# EasyEDA schematic schematics.json

## Sheets
1 PCB en Paralelo: TITLE: Sheet_1; REV: 1.0; Date: 2025-01-07; Sheet: 1/1; Drawn By: a01800096; Company: Your Company
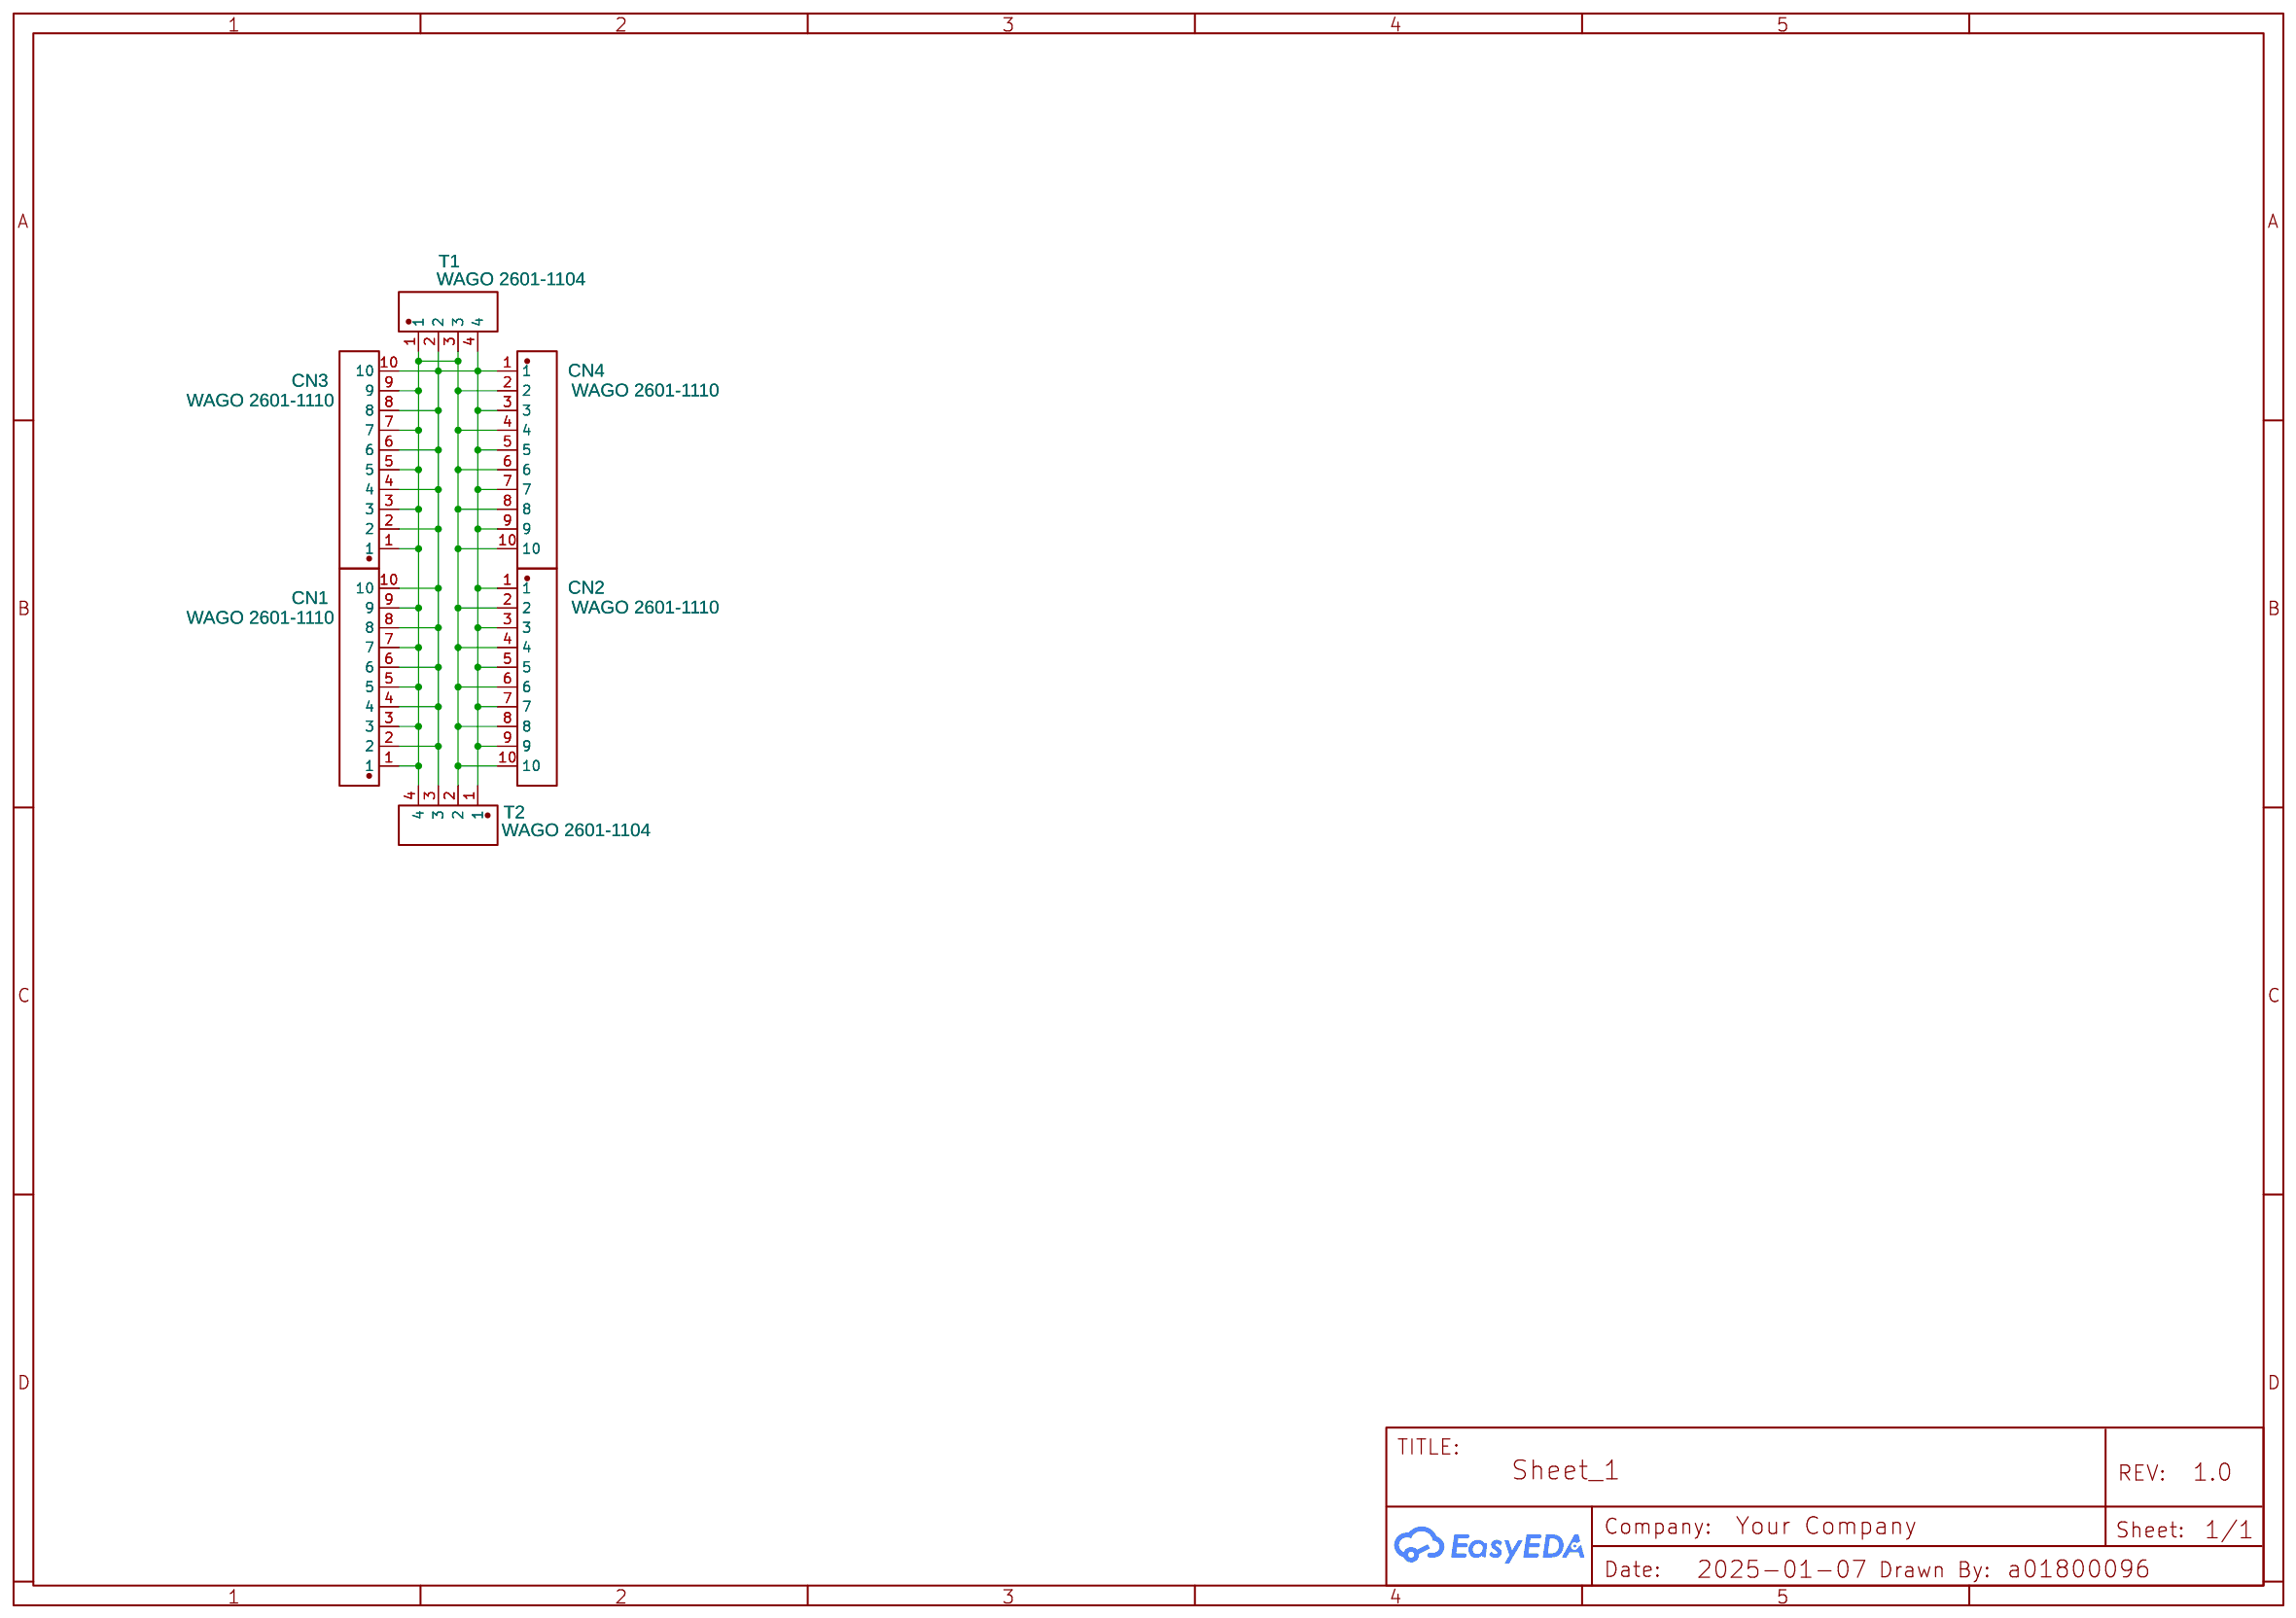
[diagram p0: PCB en Paralelo]
2 PCB Final
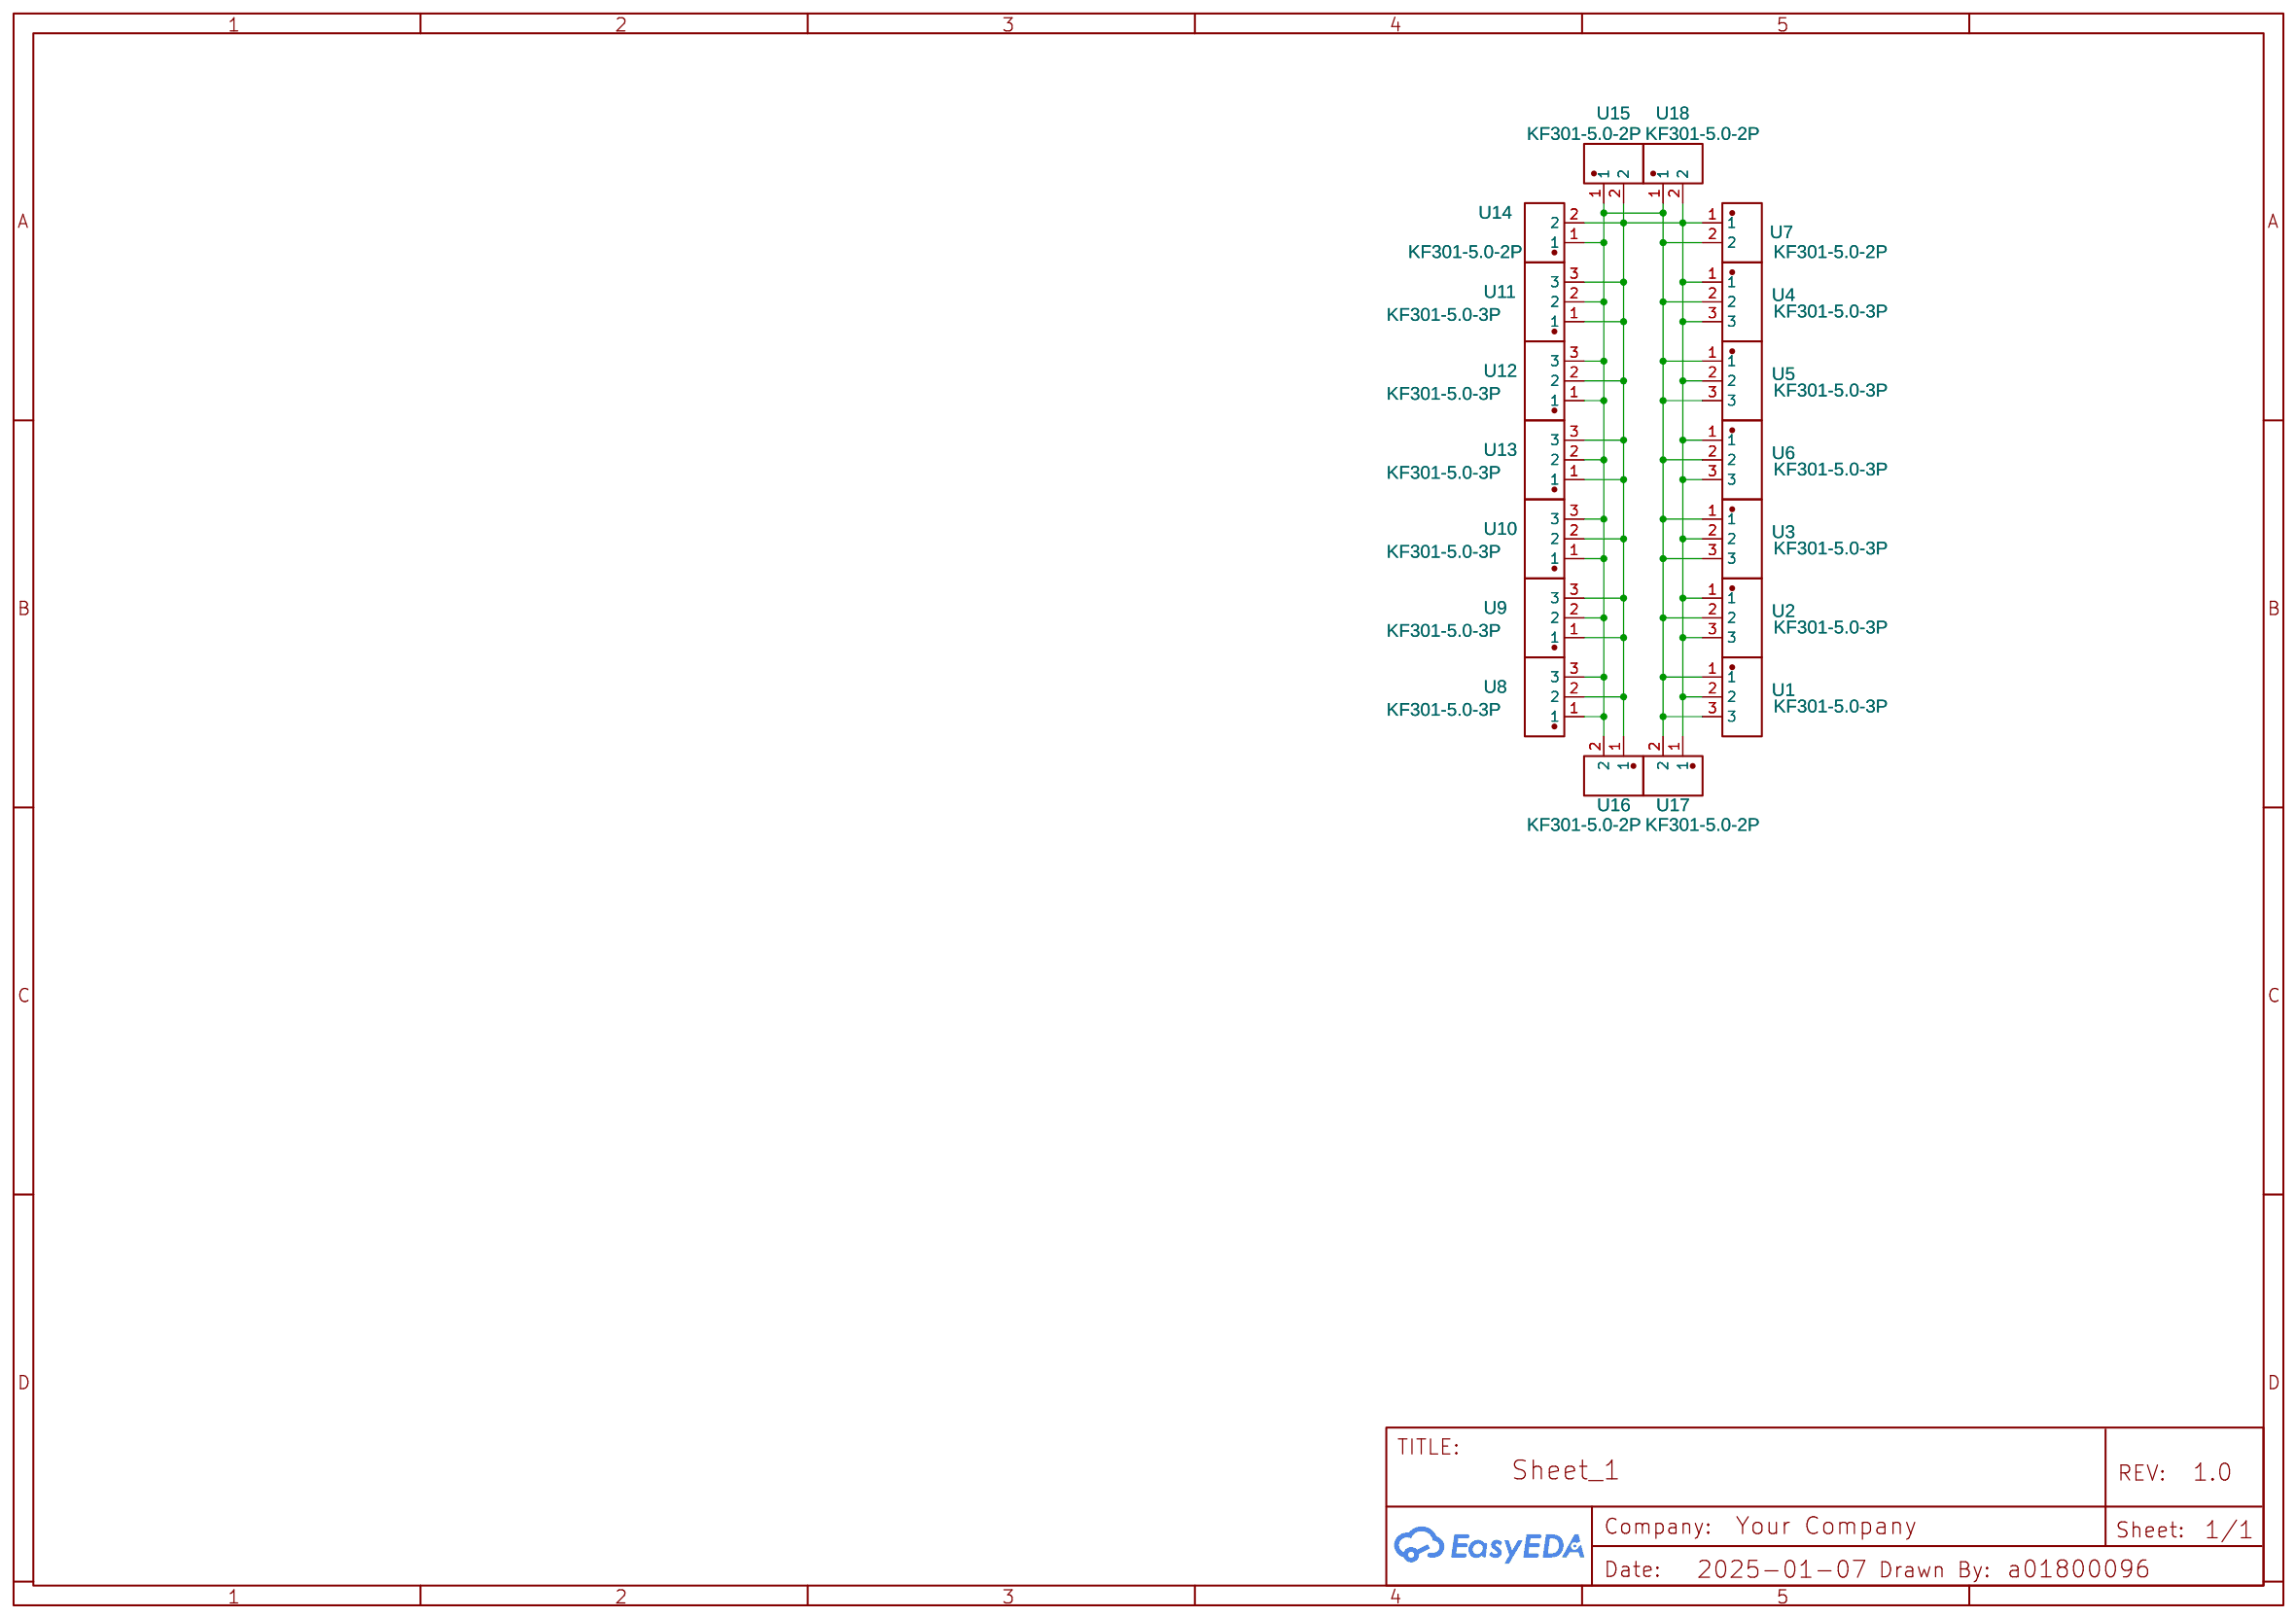
[diagram p1: PCB Final]

## Parts
sheet PCB en Paralelo
CN1  WAGO 2601-1110  [WAGO 2601-1110 2]
CN2  WAGO 2601-1110  [WAGO 2601-1110 2]
CN3  WAGO 2601-1110  [WAGO 2601-1110 2]
CN4  WAGO 2601-1110  [WAGO 2601-1110 2]
T1  WAGO 2601-1104  [WAGO 2601-1104]
T2  WAGO 2601-1104  [WAGO 2601-1104]
sheet PCB Final
U1  KF301-5.0-3P  [CONN-TH_3P-P5.00_KF301-5.0-3P]
U2  KF301-5.0-3P  [CONN-TH_3P-P5.00_KF301-5.0-3P]
U3  KF301-5.0-3P  [CONN-TH_3P-P5.00_KF301-5.0-3P]
U4  KF301-5.0-3P  [CONN-TH_3P-P5.00_KF301-5.0-3P]
U5  KF301-5.0-3P  [CONN-TH_3P-P5.00_KF301-5.0-3P]
U6  KF301-5.0-3P  [CONN-TH_3P-P5.00_KF301-5.0-3P]
U7  KF301-5.0-2P  [CONN-TH_P5.00_KF301-5.0-2P]
U8  KF301-5.0-3P  [CONN-TH_3P-P5.00_KF301-5.0-3P]
U9  KF301-5.0-3P  [CONN-TH_3P-P5.00_KF301-5.0-3P]
U10  KF301-5.0-3P  [CONN-TH_3P-P5.00_KF301-5.0-3P]
U11  KF301-5.0-3P  [CONN-TH_3P-P5.00_KF301-5.0-3P]
U12  KF301-5.0-3P  [CONN-TH_3P-P5.00_KF301-5.0-3P]
U13  KF301-5.0-3P  [CONN-TH_3P-P5.00_KF301-5.0-3P]
U14  KF301-5.0-2P  [CONN-TH_P5.00_KF301-5.0-2P]
U15  KF301-5.0-2P  [CONN-TH_P5.00_KF301-5.0-2P]
U16  KF301-5.0-2P  [CONN-TH_P5.00_KF301-5.0-2P]
U17  KF301-5.0-2P  [CONN-TH_P5.00_KF301-5.0-2P]
U18  KF301-5.0-2P  [CONN-TH_P5.00_KF301-5.0-2P]

## Library data of the parts
CN1-CN4 = WAGO 2601-1110: Contributor: LCSC; Supplier: LCSC; Supplier Part: C9900011140; Manufacturer: null; Manufacturer Part: CONNECTOR; JLCPCB Part Class: Extended Part
T1 T2 = WAGO 2601-1104
U1-U6 U8-U13 = KF301-5.0-3P: Contributor: LCSC; Supplier: LCSC; Supplier Part: C474882; Manufacturer: KEFA(科发); JLCPCB Part Class: Extended Part
U7 U14-U18 = KF301-5.0-2P: Contributor: LCSC; Supplier: LCSC; Supplier Part: C474881; Manufacturer: KEFA(科发); JLCPCB Part Class: Extended Part

## Nets
Net-(CN1-1): CN1.1 CN1.3 CN1.5 CN1.7 CN1.9 CN2.2 CN2.4 CN2.6 CN2.8 CN2.10 CN3.1 CN3.3 CN3.5 CN3.7 CN3.9 CN4.2 CN4.4 CN4.6 CN4.8 CN4.10 T1.1 T1.3 T2.2 T2.4
Net-(CN1-2): CN1.2 CN1.4 CN1.6 CN1.8 CN1.10 CN2.1 CN2.3 CN2.5 CN2.7 CN2.9 CN3.2 CN3.4 CN3.6 CN3.8 CN3.10 CN4.1 CN4.3 CN4.5 CN4.7 CN4.9 T1.2 T1.4 T2.1 T2.3
Net-(U1-1): U1.1 U1.3 U2.2 U3.1 U3.3 U4.2 U5.1 U5.3 U6.2 U7.2 U8.1 U8.3 U9.2 U10.1 U10.3 U11.2 U12.1 U12.3 U13.2 U14.1 U15.1 U16.2 U17.2 U18.1
Net-(U1-2): U1.2 U2.1 U2.3 U3.2 U4.1 U4.3 U5.2 U6.1 U6.3 U7.1 U8.2 U9.1 U9.3 U10.2 U11.1 U11.3 U12.2 U13.1 U13.3 U14.2 U15.2 U16.1 U17.1 U18.2
